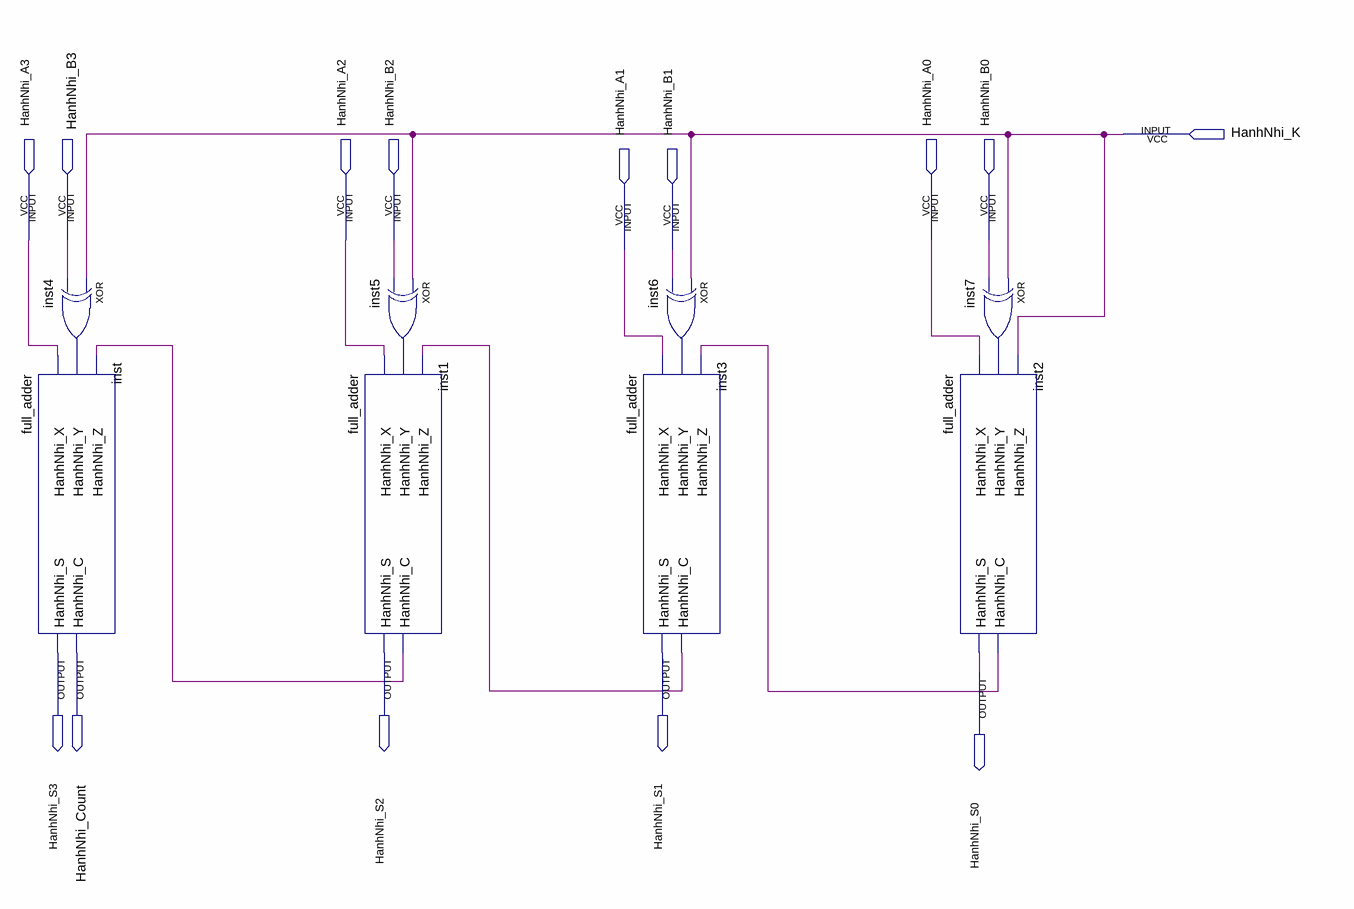
[diagram p0: schematic sheet]
// Quartus schematic adder_subtractor.bdf as structural Verilog: 8 symbols, 14 pins
module adder_subtractor (
  input  HanhNhi_K,
  input  HanhNhi_A3,
  input  HanhNhi_B3,
  input  HanhNhi_A2,
  input  HanhNhi_B2,
  input  HanhNhi_A0,
  input  HanhNhi_B0,
  input  HanhNhi_A1,
  input  HanhNhi_B1,
  output HanhNhi_S3,
  output HanhNhi_Count,
  output HanhNhi_S2,
  output HanhNhi_S1,
  output HanhNhi_S0
);

  wire inst1_hanhnhi_c, inst2_hanhnhi_c, inst3_hanhnhi_c, inst4_out, inst5_out, inst6_out, inst7_out;

  xor inst4 (inst4_out, HanhNhi_K, HanhNhi_B3);
  full_adder inst (
    .HanhNhi_X(HanhNhi_A3), .HanhNhi_Y(inst4_out), .HanhNhi_Z(inst1_hanhnhi_c), .HanhNhi_S(HanhNhi_S3),
    .HanhNhi_C(HanhNhi_Count));
  xor inst5 (inst5_out, HanhNhi_K, HanhNhi_B2);
  full_adder inst1 (
    .HanhNhi_X(HanhNhi_A2), .HanhNhi_Y(inst5_out), .HanhNhi_Z(inst3_hanhnhi_c), .HanhNhi_S(HanhNhi_S2),
    .HanhNhi_C(inst1_hanhnhi_c));
  full_adder inst3 (
    .HanhNhi_X(HanhNhi_A1), .HanhNhi_Y(inst6_out), .HanhNhi_Z(inst2_hanhnhi_c), .HanhNhi_S(HanhNhi_S1),
    .HanhNhi_C(inst3_hanhnhi_c));
  xor inst6 (inst6_out, HanhNhi_K, HanhNhi_B1);
  xor inst7 (inst7_out, HanhNhi_K, HanhNhi_B0);
  full_adder inst2 (
    .HanhNhi_X(HanhNhi_A0), .HanhNhi_Y(inst7_out), .HanhNhi_Z(HanhNhi_K), .HanhNhi_S(HanhNhi_S0),
    .HanhNhi_C(inst2_hanhnhi_c));
endmodule
